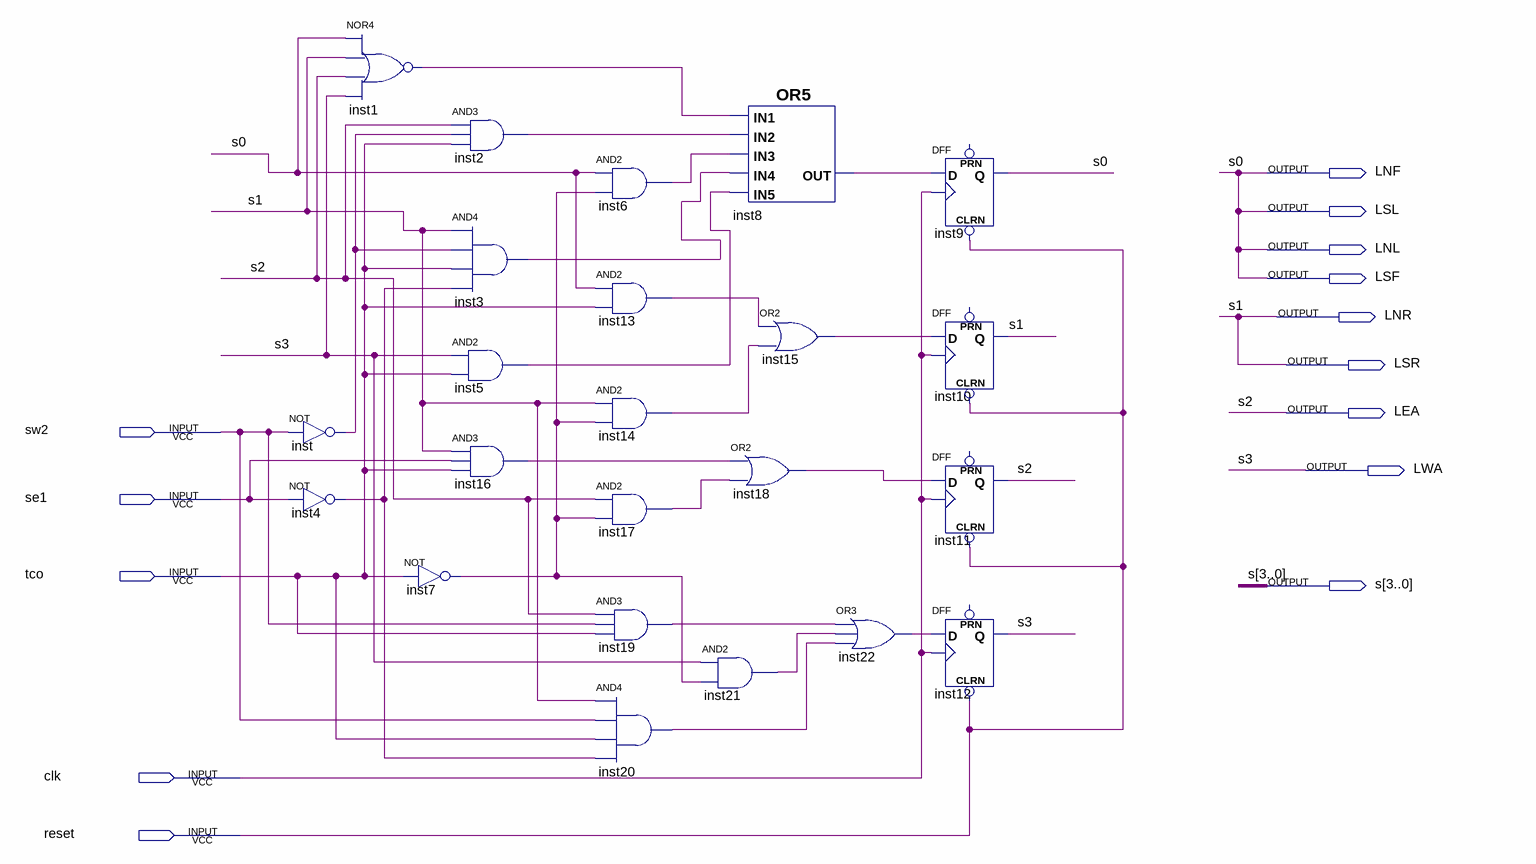
[diagram p0: schematic sheet]
// Quartus schematic traffic_control.bdf as structural Verilog: 23 symbols, 14 pins
module traffic_control (
  input  sw2,
  input  se1,
  input  tco,
  input  clk,
  input  reset,
  output LNF,
  output LSL,
  output LNL,
  output LSF,
  output LNR,
  output LSR,
  output LEA,
  output LWA,
  output [3:0] s
);

  wire inst1_out, inst2_out, inst3_out, inst4_out, inst5_out, inst6_out, inst7_out, inst8_out, inst13_out,
       inst14_out, inst15_out, inst16_out, inst17_out, inst18_out, inst19_out, inst20_out, inst21_out,
       inst22_out, inst_out;

  not inst (inst_out, sw2);
  not inst4 (inst4_out, se1);
  nor inst1 (inst1_out, LNF, LNR, LEA, LWA);
  and inst2 (inst2_out, LEA, inst_out, tco);
  and inst3 (inst3_out, LNR, inst_out, tco, inst4_out);
  and inst5 (inst5_out, LWA, tco);
  and inst16 (inst16_out, LNR, se1, tco);
  not inst7 (inst7_out, tco);
  and inst6 (inst6_out, LNF, inst7_out);
  and inst13 (inst13_out, LNF, tco);
  and inst14 (inst14_out, LNR, inst7_out);
  and inst17 (inst17_out, LEA, inst7_out);
  and inst19 (inst19_out, LEA, sw2, tco);
  and inst20 (inst20_out, LNR, sw2, tco, inst4_out);
  or inst8 (inst8_out, inst1_out, inst2_out, inst6_out, inst3_out, inst5_out);
  or inst15 (inst15_out, inst13_out, inst14_out);
  or inst18 (inst18_out, inst16_out, inst17_out);
  and inst21 (inst21_out, LWA, inst7_out);
  or inst22 (inst22_out, inst19_out, inst21_out, inst20_out);
  DFF inst9 (.CLRN(reset), .CLK(clk), .D(inst8_out), .Q(LNF));  // open: PRN
  DFF inst10 (.CLRN(reset), .CLK(clk), .D(inst15_out), .Q(LNR));  // open: PRN
  DFF inst11 (.CLRN(reset), .CLK(clk), .D(inst18_out), .Q(LEA));  // open: PRN
  DFF inst12 (.CLRN(reset), .CLK(clk), .D(inst22_out), .Q(LWA));  // open: PRN

  assign LNL = LNF;
  assign LSF = LNF;
  assign LSL = LNF;
  assign LSR = LNR;
  assign s = {LWA, LEA, LNR, LNF};

  // Other names for the same wires on the sheet: s0 = LNF; s1 = LNR; s2 = LEA; s3 = LWA
endmodule
